# EAGLE design power-icl7662 (EAGLE 7.5.0)
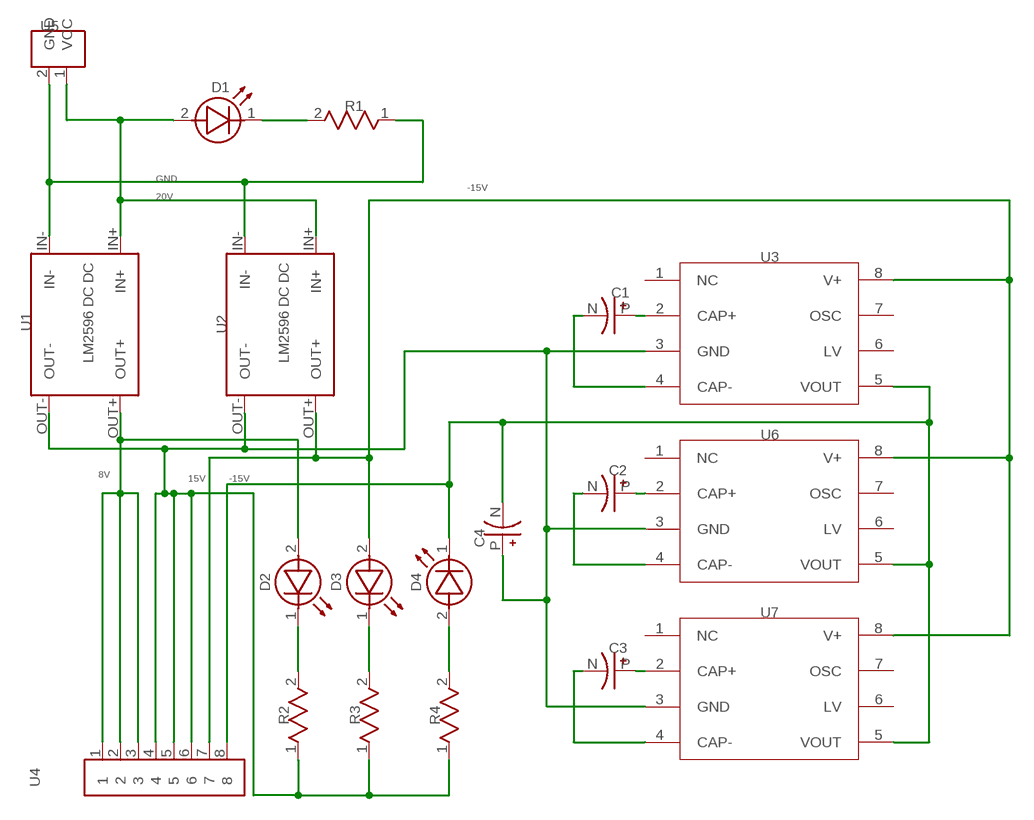
[diagram p0: schematic, sheet 1]

## Parts
C1  10µF 25V  EEUHD1H100  [CAPPRD250W50D500H1100]
C2  10µF 25V  EEUHD1H100  [CAPPRD250W50D500H1100]
C3  10 µF 25V  EEUHD1H100  [CAPPRD250W50D500H1100]
C4  47µF 25V  EEUHD1H100  [CAPPRD250W50D500H1100]
D1  RED  LED  [LED100]
D2  GREEN  LED  [LED100]
D3  YELLOW  LED  [LED100]
D4  BLEUE  LED  [LED100]
R1  2200  SFR2500001002FR500  [RESAD1190W58L750D250]
R2  2200  SFR2500001002FR500  [RESAD1190W58L750D250]
R3  2200  SFR2500001002FR500  [RESAD1190W58L750D250]
R4  2200  SFR2500001002FR500  [RESAD1190W58L750D250]
U1  LM2596DCDC  [LM2596DCDC]
U2  LM2596DCDC  [LM2596DCDC]
U3  ICL7662-PDIP  [DIL-08]
U4  1X8.PTS  [PHOENIX-200-8]
U5  1X2.PTS  [PHOENIX-200-2]
U6  ICL7662-PDIP  [DIL-08]
U7  ICL7662-PDIP  [DIL-08]

## Nets
8V [8V]: D2.2(A) U1.OUT+ U4.1 U4.2 U4.3
15V [15]: D3.2(A) U2.OUT+ U3.8(V+) U4.7 U6.8(V+) U7.8(V+)
20V [20V]: D1.2(A) U1.IN+ U2.IN+ U5.1(VCC)
-15V [15]: C4.N D4.1(K) U3.5(VOUT) U4.8 U6.5(VOUT) U7.5(VOUT)
GND [GND]: C4.P R1.1 R2.1 R3.1 R4.1 U1.IN- U1.OUT- U2.IN- U2.OUT- U3.3(GND) U4.4 U4.5 U4.6 U5.2(GND) U6.3(GND) U7.3(GND)
Net_5: D1.1(K) R1.2
Net_6: D2.1(K) R2.2
Net_7: D3.1(K) R3.2
Net_8: D4.2(A) R4.2
Net_9: C1.P U3.2(CAP+)
Net_10: C2.P U6.2(CAP+)
Net_11: C3.P U7.2(CAP+)
Net_12: C1.N U3.4(CAP-)
Net_13: C2.N U6.4(CAP-)
Net_14: C3.N U7.4(CAP-)
Unconnected: U3.1(NC) U3.6(LV) U3.7(OSC) U6.1(NC) U6.6(LV) U6.7(OSC) U7.1(NC) U7.6(LV) U7.7(OSC)

## Notes on the sheet
- U5
- D1
- R1
- GND
- -15V
- 20V
- LM2596 DC DC | LM2596 DC DC | U3
- C1
- U1 | U2
- U6
- 8V | C2
- 15V | -15V
- C4
- D2 | D3 | D4
- U7
- C3
- R2 | R3 | R4
- U4

## Library data of the parts
C1 C2 = common:EEUHD1H100; DESCRIPTION: Cap Aluminum Lytic 10uF 50V 20% (5 X 11mm) Radial 2mm 39mA 1000h 105C Automotive Bulk
C3 C4 = common:EEUHD1H100; DESCRIPTION: Cap Aluminum Lytic 10uF 50V 20% (5 X 11mm) Radial 2mm 39mA 1000h 105C Automotive Bulk; VALUE: 10µF 25V
D1 = common:LED; UNIQUE_NAME: LED100
D2-D4 = common:LED; UNIQUE_NAME: LED100; VALUE: RED
R1-R4 = common:SFR2500001002FR500; DATASHEET: http://datasheets.diptrace.com/vishay/sfr16s25.pdf; MANUFACTURER: Vishay; PART_NUMBER_(DIGI-KEY): PPC10.0KYTR-ND; PART_NUMBER_(MOUSER): 594-5043ED10K00F; UNIQUE_NAME: VISHAY_SFR25
U1 U2 = common:LM2596DCDC
U3 U6 U7 = common:ICL7662-PDIP
U4 = common:1X8.PTS
U5 = common:1X2.PTS

## Net classes
0 Default: width 1.905 mm, clearance 1.905 mm
1 GND: width 19.05 mm, clearance 3.81 mm
2 20V: width 1.905 mm, clearance 3.81 mm
3 15: width 1.905 mm, clearance 2.794 mm
4 8V: width 2.794 mm, clearance 2.794 mm

## Board
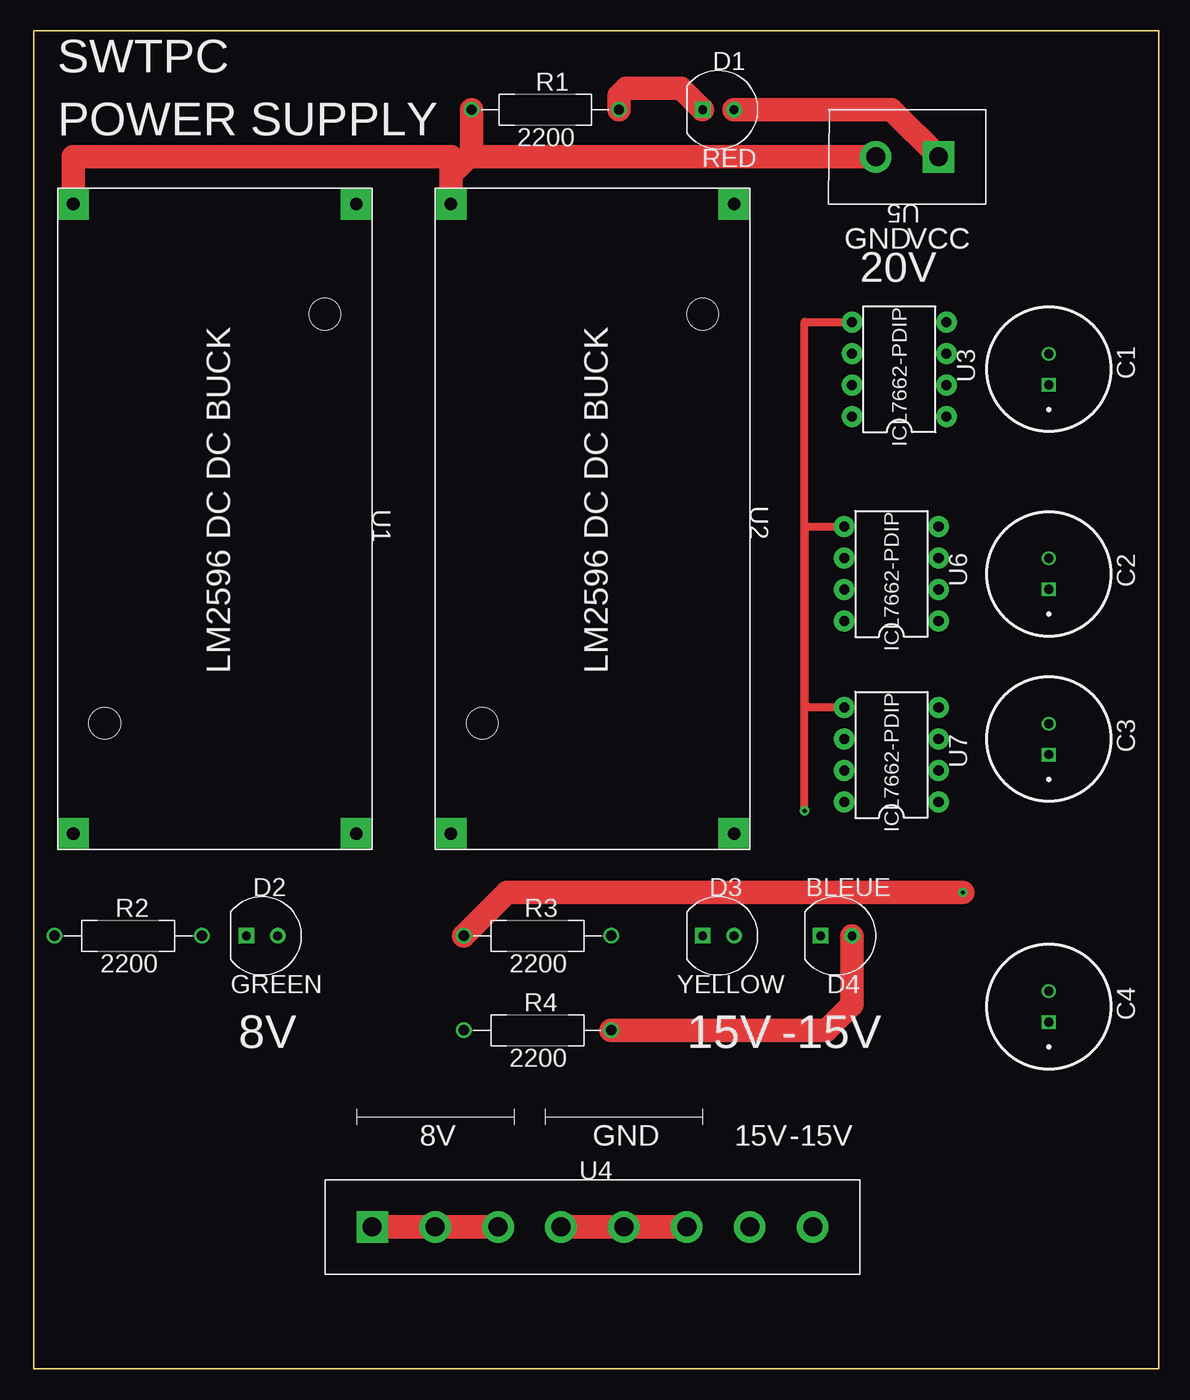
[diagram p1: board, top side]
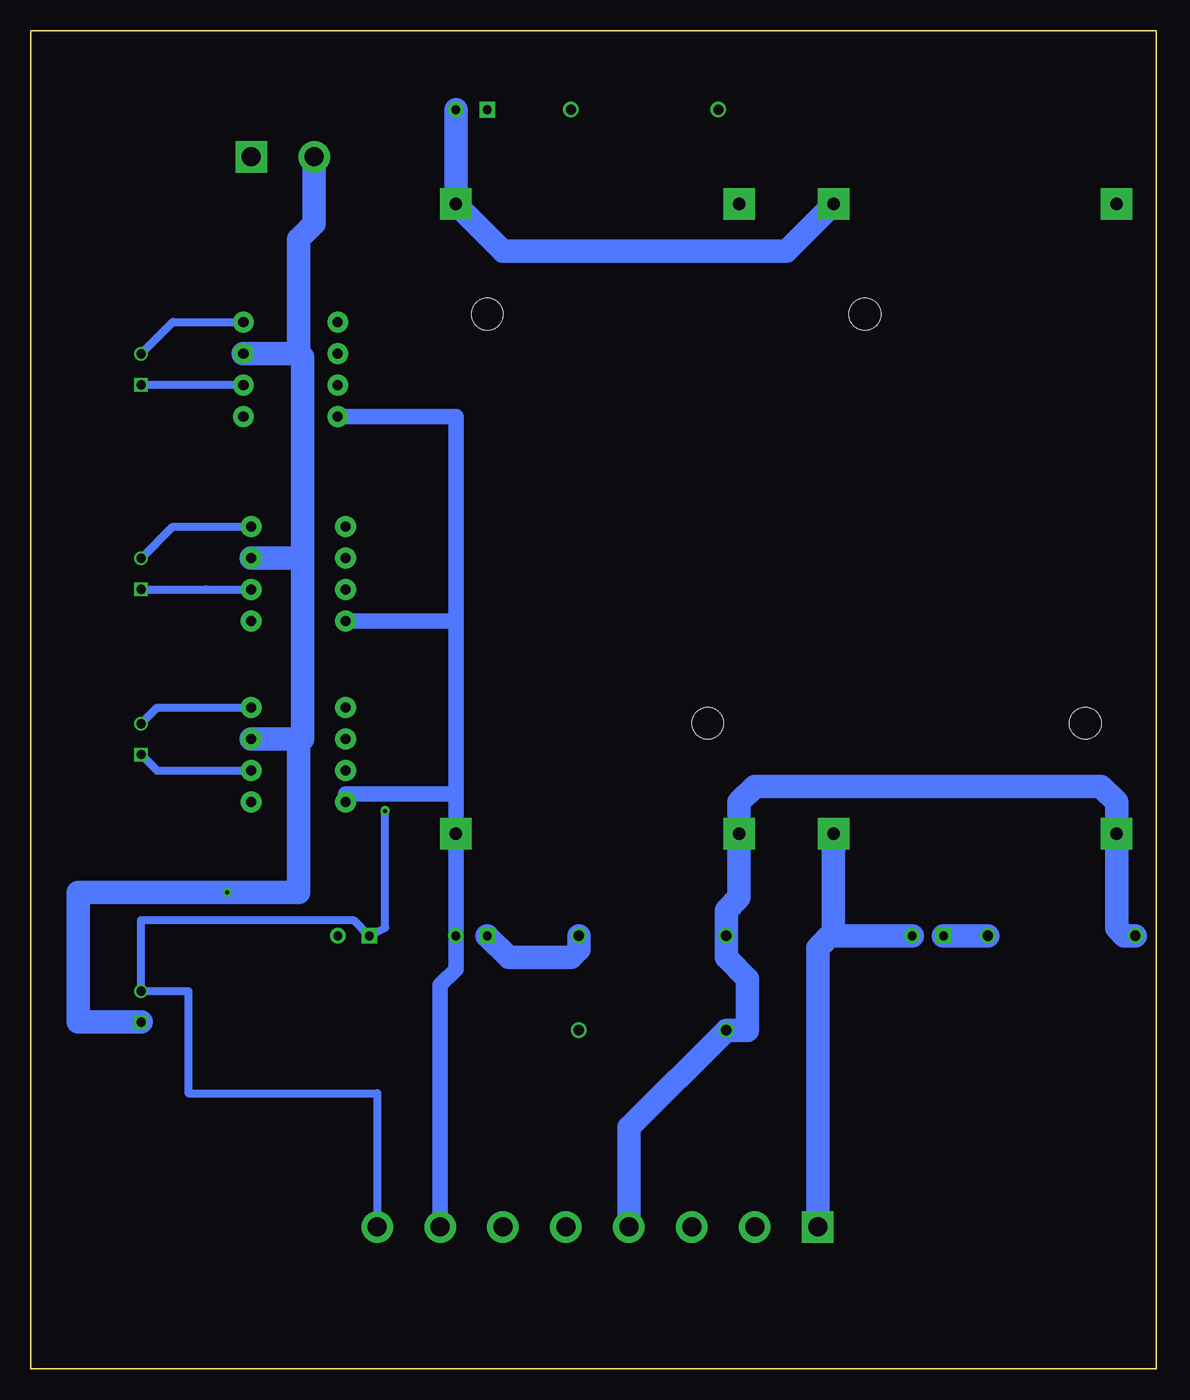
[diagram p2: board, bottom side, seen from below]

Size 90.81 x 107.95 mm. Coordinates in mm from the lower left corner, seen from the top.
Outline: 0,107.95 90.81,107.95 90.81,0 0,0 0,107.95
Copper layers (1*16): Top 0.035mm / dielectric 1.5mm / Bottom 0.035mm
Design rules "default *": minimum track width 10mil, minimum drill 0.61mm, track to track 8mil, track to pad 8mil, pad to pad 8mil, via to via 8mil, smd to smd 8mil, copper to edge 40mil, drill to drill 8mil, minimum pad ring 0mil, minimum via ring 8mil, stop-mask expansion 2mil, vias tented up to drill 13mil, thermal gap 10mil

### Footprints (pad centres in the part's own frame; a part is rotated, then mirrored left to right if it is on the bottom)
CAPPRD250W50D500H1100 = drill 0.75 pad 1.1: N 1.25,0 | drill 0.75 pad 1.1 square: P -1.25,0
LED100 = drill 0.711 pad 1.27 square: 1 -1.27,0 | drill 0.711 pad 1.27: 2 1.27,0
RESAD1190W58L750D250 = drill 0.83 pad 1.25: 1 -5.95,0; 2 5.95,0
LM2596DCDC = drill 1.016 pad 2.54 square: IN+ -25.4,11.43; IN- -25.4,-11.43; OUT+ 25.4,11.43; OUT- 25.4,-11.43 | hole 2.54: -16.51,8.89; 16.51,-8.89
DIL-08 = drill 0.813 pad 1.676: 1 -3.81,-3.81; 2 -1.27,-3.81; 3 1.27,-3.81; 4 3.81,-3.81; 5 3.81,3.81; 6 1.27,3.81; 7 -1.27,3.81; 8 -3.81,3.81
PHOENIX-200-8 = drill 1.524 pad 2.54 square: 1 0,0 | drill 1.524 pad 2.54: 2 5.08,0; 3 10.16,0; 4 15.24,0; 5 20.32,0; 6 25.4,0; 7 30.48,0; 8 35.56,0
PHOENIX-200-2 = drill 1.524 pad 2.54 square: 1 0,0 | drill 1.524 pad 2.54: 2 5.08,0

### Placement (x,y rotation side)
C1  81.91,80.64 90 top
C2  81.91,64.13 90 top
C3  81.91,50.8 90 top
C4  81.91,29.21 90 top
D1  55.24,101.6 0 top
D2  18.41,34.92 0 top
D3  55.24,34.92 0 top
D4  64.77,34.92 0 top
R1  41.27,101.6 0 top
R2  7.62,34.92 0 top
R3  40.64,34.92 0 top
R4  40.64,27.3 0 top
U1  14.6,68.58 270 top
U2  45.09,68.58 270 top
U3  69.85,80.64 90 top
U4  27.3,11.43 0 top
U5  73.03,97.79 180 top
U6  69.22,64.13 90 top
U7  69.22,49.53 90 top

### Tracks (layer width: path | path; a pad name or v marks a point on that pad's centre or on a via)
8V
  Top 1.905: U4.3 U4.2 U4.1
  Bottom 1.905: U4.1 27.3,33.96 26.04,35.23 | 26.04,35.23 U1.OUT+ | 26.04,35.23 25.73,34.92 D2.2
15V
  Bottom 1.27: 65.41,46.35 U7.8 65.41,46.35 | 65.41,46.35 56.52,46.35 | 56.52,46.35 56.52,60.32 | 56.52,60.32 56.52,76.83 U3.8 | U2.OUT+ 56.52,46.35 | 56.52,46.35 65.41,46.35 | D3.2 U2.OUT+ | 56.52,60.32 65.52,60.32 | 65.52,60.32 | 65.52,60.32 U6.8 | U2.OUT+ 56.52,32.22 57.78,30.95 U4.7
20V
  Top 1.905: D1.2 69.22,101.6 U5.1
  Bottom 1.905: U1.IN+ 29.84,90.17 52.7,90.17 U2.IN+ D1.2
-15V  (via drill 0.33 pad 0.69)
  Top 0.635: 62.21,53.34 U7.5 62.23,53.34 62.23,67.96 65.63,67.96 | 62.21,53.34 62.21,84.45 U3.5 | v62.21,45.02 62.21,53.34 | U6.5 65.63,67.96 | 65.63,67.96 U6.5 | 65.63,67.96 U6.5
  Bottom 0.635: U4.8 62.87,22.22 78.11,22.22 78.11,30.46 C4.N 81.91,36.2 64.77,36.2 D4.1 62.21,35.57 v62.21,45.02
GND  (via drill 0.33 pad 0.69)
  Top 1.905: U5.2 35.33,97.79 R1.1 35.33,98.02 33.66,96.35 U2.IN- 33.66,97.79 3.17,97.79 U1.IN- | R3.1 38.2,38.43 v74.97,38.43 | U4.4 U4.5 U4.6
  Bottom 1.905: U4.4 42.55,19.45 R4.1 32.96,27.3 32.96,31.46 34.69,33.2 R3.1 34.69,36.98 33.66,38.02 U2.OUT- 33.66,45.72 32.39,46.99 4.45,46.99 3.17,45.72 U1.OUT- 3.17,35.55 2.55,34.92 R2.1 | C4.P 87,27.96 87,38.43 v74.97,38.43 69.22,38.43 69.22,50.8 U7.3 68.89,50.8 68.89,65.41 | 68.89,65.41 68.89,81.61 69.19,81.91 | 69.19,81.91 69.19,91.15 67.94,92.39 U5.2 | U6.3 68.89,65.41 | 68.89,65.41 | U3.3 69.19,81.91 | 69.19,81.91
Net_5
  Top 1.905: D1.1 52.23,103.34 47.85,103.34 47.23,102.72 R1.2
Net_6
  Bottom 1.905: D2.1 R2.2
Net_7
  Bottom 1.905: D3.1 52.23,33.18 47.22,33.18 46.59,33.81 R3.2
Net_8
  Top 1.905: R4.2 63.98,27.3 66.04,29.36 D4.2
Net_9
  Bottom 0.635: C1.P 73.66,79.39 U3.2
Net_10
  Bottom 0.635: C2.P 76.67,62.88 76.66,62.86 U6.2
Net_11
  Bottom 0.635: C3.P 80.62,48.26 U7.2
Net_12
  Bottom 0.635: C1.N 79.36,84.45 U3.4
Net_13
  Bottom 0.635: C2.N 79.36,67.94 U6.4
Net_14
  Bottom 0.635: C3.N 80.62,53.34 U7.4

### Text on the board
tPlace: SWTPC | D1 | R1 | POWER SUPPLY | 2200 | RED | U5 | GND | VCC | 20V | U3 | C1 | U1 | U2 | U6 | C2 | C3 | U7 | D2 | D3 | BLEUE | R2 | R3 | 2200 | 2200 | GREEN | YELLOW | D4 | 8V | R4 | 15V | -15V | C4 | 2200 | 8V | GND | 15V | -15V | U4